# Altium schematic sheet Subsytemintrosychematic.SchDoc
size A; SheetNumber: 1; SheetTotal: 1
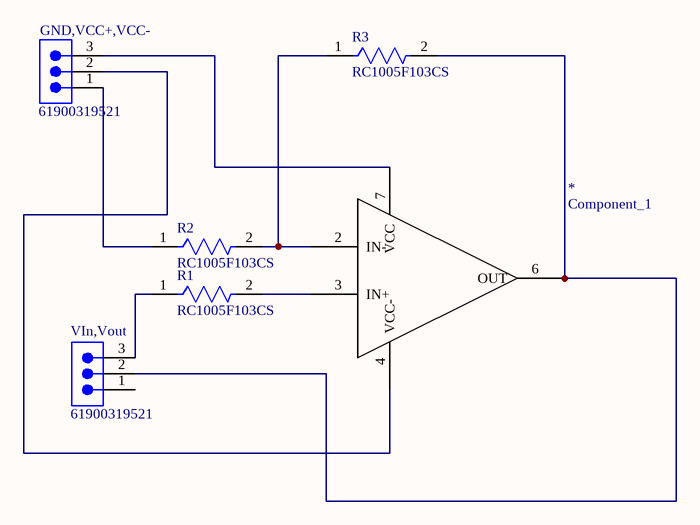
[diagram p0: Subsytemintrosychematic.SchDoc]

## Parts
*  Component_1  [PCBComponent_1]
GND,VCC+,VCC-  61900319521  [61900319521]
R1  RC1005F103CS  [FP-RC1005-IPC_A]
R2  RC1005F103CS  [FP-RC1005-IPC_A]
R3  RC1005F103CS  [FP-RC1005-IPC_A]
VIn,Vout  61900319521  [61900319521]

## Nets
Net*_2: *.2(IN-) R2.2 R3.1
Net*_3: *.3(IN+) R1.2
Net*_4: *.4(VCC-) GND,VCC+,VCC-.2
Net*_6: *.6(OUT) R3.2 VIn,Vout.2
Net*_7: *.7(VCC) GND,VCC+,VCC-.3
NetGND,VCC+,VCC-_1: GND,VCC+,VCC-.1 R2.1
NetR1_1: R1.1 VIn,Vout.3

Not connected (* = marked no-connect by the designer): VIn,Vout 1

## Library data of the parts
GND,VCC+,VCC- VIn,Vout = CMP-1502-00600-2: NexarPartId: 18818224; Connector Type: Male Pin; Contact Resistance: 20mΩ; Pitch: 2.54mm; Insulation Resistance: 1GΩ; Number of Contacts: 3; Insulation: Insulated; Gender: Male; Operating Supply Voltage: 250V; Current Rating: 3A; Number of Pins: 3; Min Operating Temperature: -40°C; Color: Beige; Contact Gender: Male; RoHS: Compliant; Max Operating Temperature: 105°C; Height: 3.3mm; Length: 7.62mm; Packaging: Bulk; Width: 7.62mm; Contact Plating: Tin; Lead Pitch: 2.54mm; Number of Rows: 1; Lead Free: Lead Free; Mount: Through Hole; Termination: Through Hole; REACH SVHC: Unknown; Number of Positions: 3; Contact Material: Copper; Contact Mating Length: 7.493mm; Flammability Rating: UL94 V-0; Housing Material: Nylon; Voltage Rating: 250V; Fastening Type: Friction
R1-R3 = CMP-13261-004522-1: Res Thick Film 0402 10kΩ 1% 0.063W ±100ppm/°C Molded SMD T/R; Max Power Dissipation: 63mW; Resistance: 10kR; Power Rating: 62.5mW; Package Quantity: 1; Depth: 0.5mm; Radiation Hardening: No; Features: Moisture Resistant; Max Operating Temperature: 155°C; Case Code (Metric): 1005; Military Standard: Not; Case/Package: 0402; Width: 0.02inch; Contact Plating: Tin; Mount: Surface Mount; Packaging: Tape and Reel; Height: 0.016inch; Case Code (Imperial): 0402; Number of Terminations: 2; Composition: Thick Film; Temperature Coefficient: 100ppm/°C; Min Operating Temperature: -55°C; Tolerance: 1%; Length: 1mm